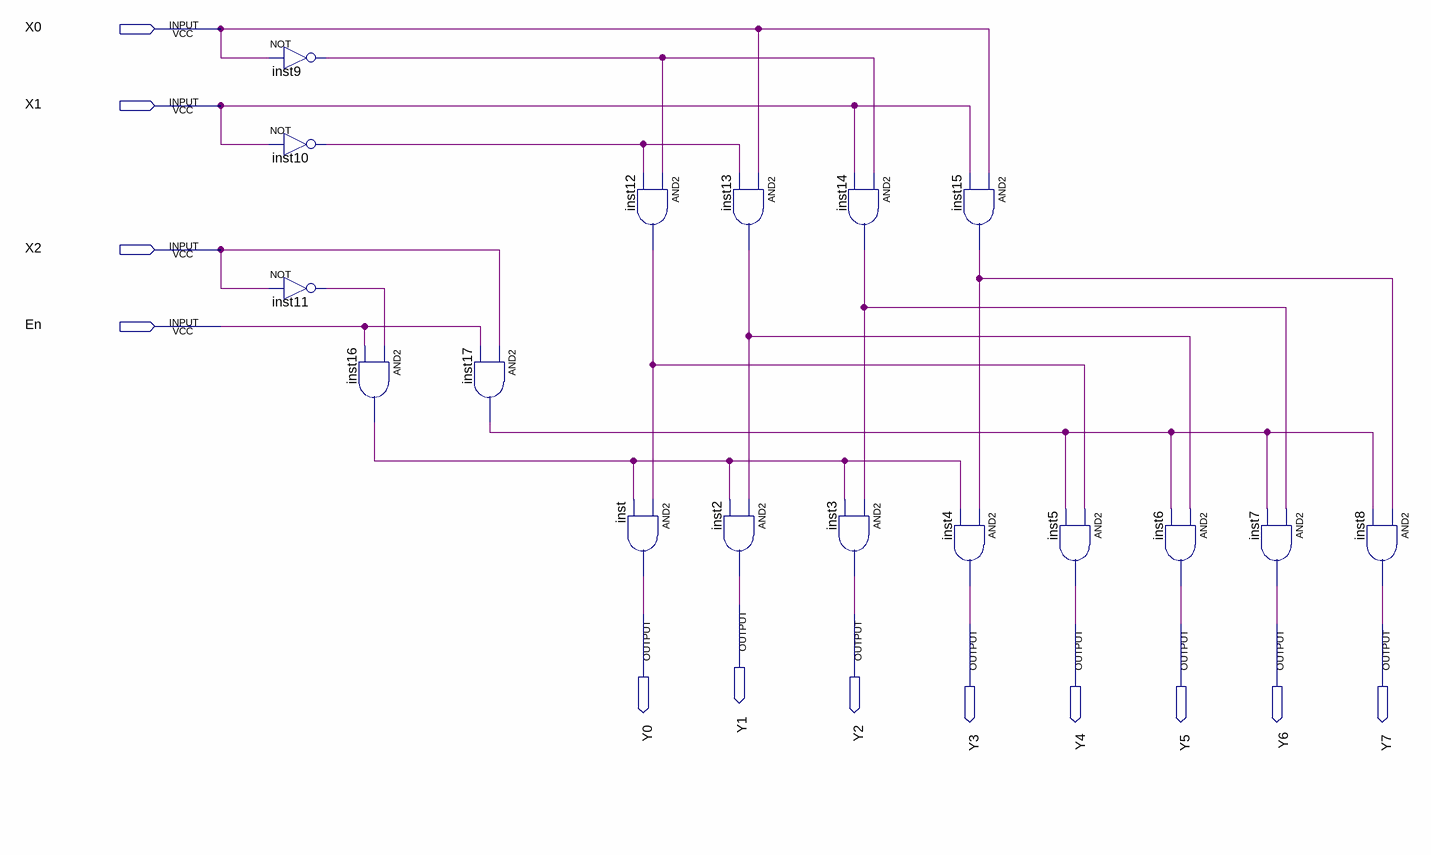
[diagram p0: schematic sheet]
// Quartus schematic q3.bdf as structural Verilog: 17 symbols, 12 pins
module q3 (
  input  X0,
  input  X1,
  input  X2,
  input  En,
  output Y1,
  output Y0,
  output Y2,
  output Y3,
  output Y4,
  output Y5,
  output Y6,
  output Y7
);

  wire inst9_out, inst10_out, inst11_out, inst12_out, inst13_out, inst14_out, inst15_out, inst16_out,
       inst17_out;

  not inst9 (inst9_out, X0);
  not inst10 (inst10_out, X1);
  not inst11 (inst11_out, X2);
  and inst16 (inst16_out, inst11_out, En);
  and inst17 (inst17_out, X2, En);
  and inst12 (inst12_out, inst9_out, inst10_out);
  and inst (Y0, inst12_out, inst16_out);
  and inst13 (inst13_out, X0, inst10_out);
  and inst2 (Y1, inst13_out, inst16_out);
  and inst14 (inst14_out, inst9_out, X1);
  and inst3 (Y2, inst14_out, inst16_out);
  and inst15 (inst15_out, X0, X1);
  and inst4 (Y3, inst15_out, inst16_out);
  and inst5 (Y4, inst12_out, inst17_out);
  and inst6 (Y5, inst13_out, inst17_out);
  and inst7 (Y6, inst14_out, inst17_out);
  and inst8 (Y7, inst15_out, inst17_out);
endmodule
